# Altium schematic sheet 7d - Sensors.SchDoc
size A4
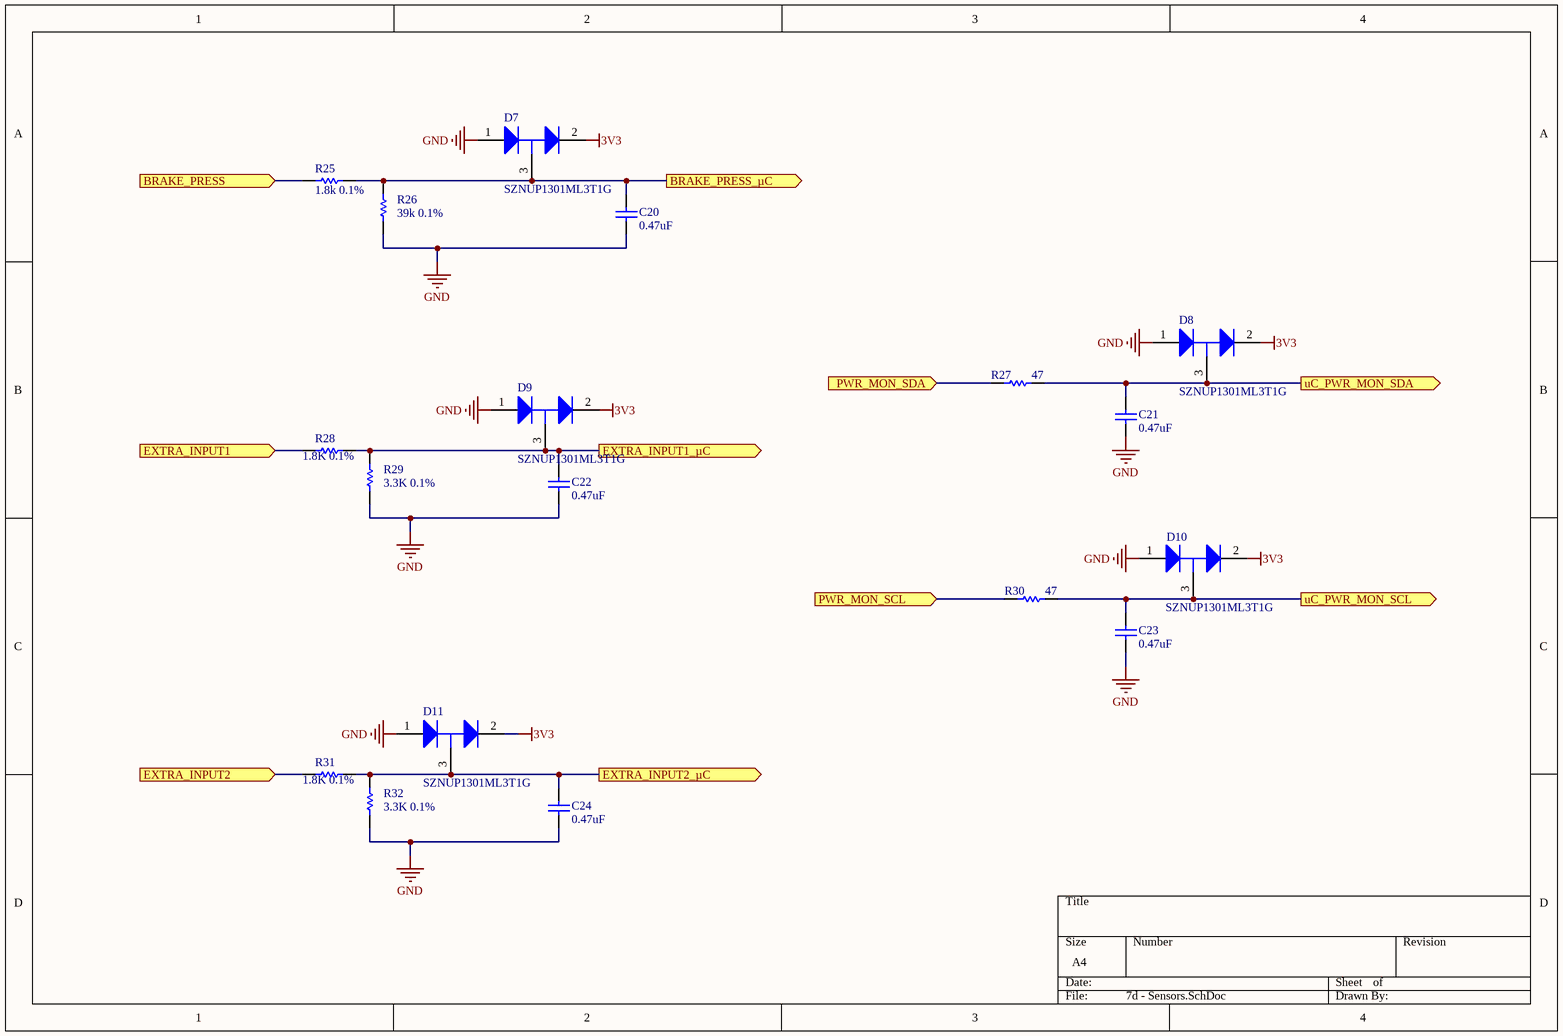
[diagram p0: 7d - Sensors.SchDoc]

## Parts
C20  value 0.47uF  [1608[0603]]  (hidden comment: Cap)
C21  value 0.47uF  [1608[0603]]  (hidden comment: Cap)
C22  value 0.47uF  [1608[0603]]  (hidden comment: Cap)
C23  value 0.47uF  [1608[0603]]  (hidden comment: Cap)
C24  value 0.47uF  [1608[0603]]  (hidden comment: Cap)
D7  SZNUP1301ML3T1G  [ONSC-SOT-23-3-318-08_V]
D8  SZNUP1301ML3T1G  [ONSC-SOT-23-3-318-08_V]
D9  SZNUP1301ML3T1G  [ONSC-SOT-23-3-318-08_V]
D10  SZNUP1301ML3T1G  [ONSC-SOT-23-3-318-08_V]
D11  SZNUP1301ML3T1G  [ONSC-SOT-23-3-318-08_V]
R25  value 1.8k 0.1%  [1608[0603]]  (hidden comment: Res1)
R26  value 39k 0.1%  [1608[0603]]  (hidden comment: Res1)
R27  value 47  [1608[0603]]  (hidden comment: Res1)
R28  value 1.8K 0.1%  [1608[0603]]  (hidden comment: Res1)
R29  value 3.3K 0.1%  [1608[0603]]  (hidden comment: Res1)
R30  value 47  [1608[0603]]  (hidden comment: Res1)
R31  value 1.8K 0.1%  [1608[0603]]  (hidden comment: Res1)
R32  value 3.3K 0.1%  [1608[0603]]  (hidden comment: Res1)

## Ports
BRAKE_PRESS (in), BRAKE_PRESS_µC (out), EXTRA_INPUT1 (in), EXTRA_INPUT1_µC (out), EXTRA_INPUT2 (in), EXTRA_INPUT2_µC (out), PWR_MON_SCL (in), PWR_MON_SDA (in), uC_PWR_MON_SCL (out), uC_PWR_MON_SDA (out)

## Nets
3V3: D7.2(K) D8.2(K) D9.2(K) D10.2(K) D11.2(K)
GND: C20.1 C21.1 C22.1 C23.1 C24.1 D7.1(A) D8.1(A) D9.1(A) D10.1(A) D11.1(A) R26.1 R29.1 R32.1
BRAKE_PRESS: R25.2 ; port BRAKE_PRESS
BRAKE_PRESS_µC: C20.2 D7.3(K/A) R25.1 R26.2 ; port BRAKE_PRESS_µC
EXTRA_INPUT1: R28.2 ; port EXTRA_INPUT1
EXTRA_INPUT1_µC: C22.2 D9.3(K/A) R28.1 R29.2 ; port EXTRA_INPUT1_µC
EXTRA_INPUT2: R31.2 ; port EXTRA_INPUT2
EXTRA_INPUT2_µC: C24.2 D11.3(K/A) R31.1 R32.2 ; port EXTRA_INPUT2_µC
PWR_MON_SCL: R30.1 ; port PWR_MON_SCL
PWR_MON_SDA: R27.1 ; port PWR_MON_SDA
uC_PWR_MON_SCL: C23.2 D10.3(K/A) R30.2 ; port uC_PWR_MON_SCL
uC_PWR_MON_SDA: C21.2 D8.3(K/A) R27.2 ; port uC_PWR_MON_SDA

## Library data of the parts
C20-C24 = Cap: Capacitor; Published: 8-Jun-2000; LatestRevisionDate: 17-Jul-2002; LatestRevisionNote: Re-released for DXP Platform.; PackageReference: RAD-0.3; Publisher: Altium Limited; PackageDescription: Radial Cap, Thru-Hole; 2 Leads; 0.3 in Pin Spacing
D7-D11 = CMP-1063-00171-1: Low Capacitance Diode Array for ESD Protection in a Single Data Line, 3-Pin SOT-23, Pb-Free, Tape and Reel; Manufacturer: On Semiconductor; C Max (pF): 0.9; Direction: Bidirectional; V(BR) Min (V): 70; Number of Lines: 1; Mounting Technology: Surface Mount; PackageReference: SOT-23-3-318-08; DatasheetVersion: Rev. 6; PackageVersion: Rev. AP, 11/2009; RoHS: Pb-Free; ComponentLink1Description: Manufacturer URL; ComponentLink1URL: http://www.onsemi.com/; PackageDescription: 3-Pin Small Outline Transistor, Body 2.92 x 1.3 mm, Pitch 0.95 mm; PartNumber: SZNUP1301ML3T1G; Packing: Tape and Reel; ComponentLink3URL: http://www.onsemi.cn/pub_link/Collateral/318-08.PDF; ComponentLink3Description: Package Specification; VRWM Max (V): 70; ComponentLink2Description: Datasheet; ComponentLink2URL: http://www.onsemi.cn/pub_link/Collateral/NUP1301ML3T1-D.PDF
R25-R32 = Res1: Resistor; Published: 8-Jun-2000; LatestRevisionDate: 17-Jul-2002; LatestRevisionNote: Re-released for DXP Platform.; PackageReference: AXIAL-0.3; Publisher: Altium Limited; PackageDescription: Axial Device, Thru-Hole; 2 Leads; 0.3 in Pin Spacing